# EAGLE design drive_and_recover (EAGLE 7.1.0)
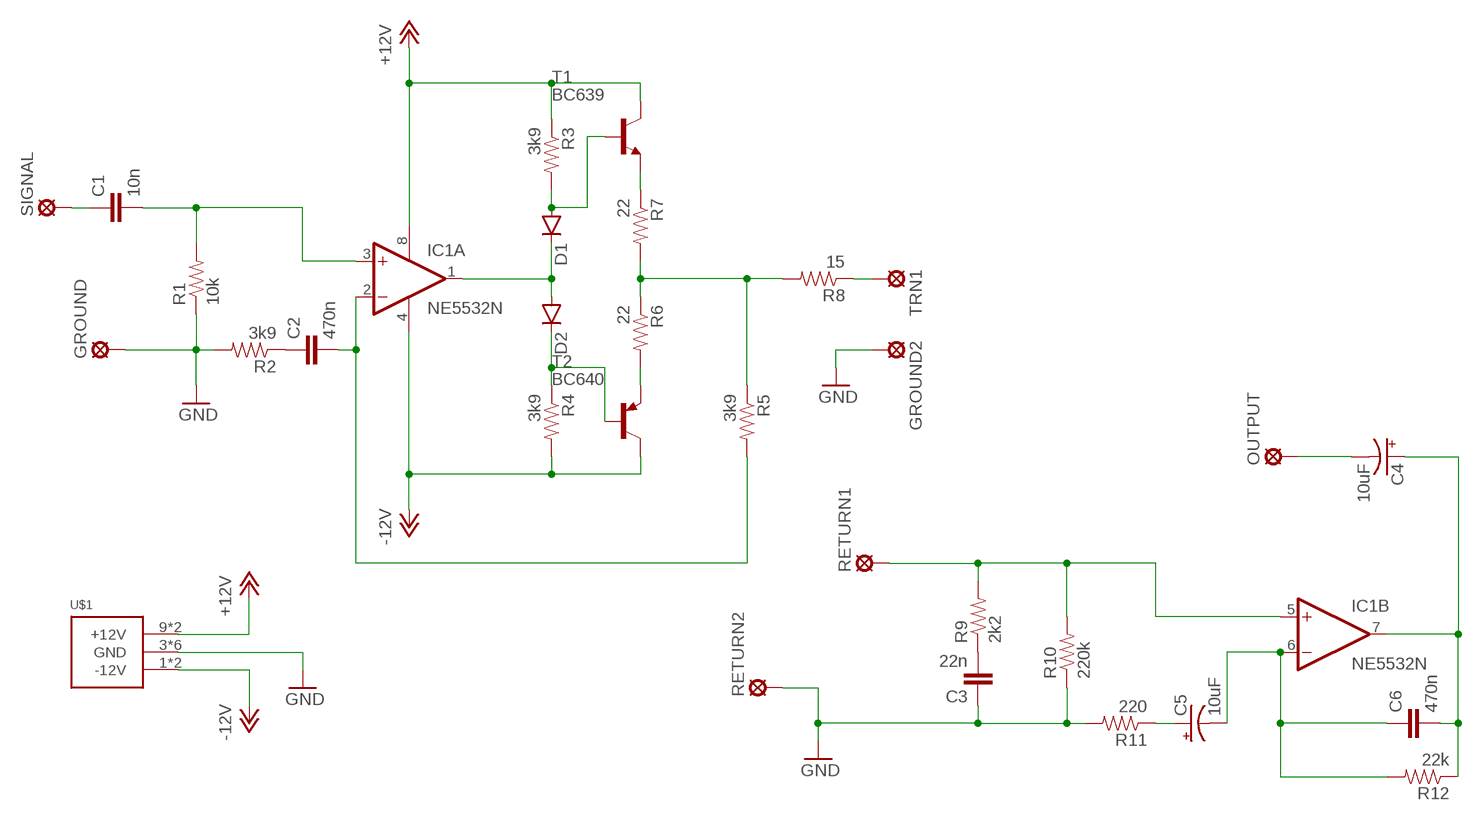
[diagram p0: schematic, sheet 1]

## Parts
C1  10n  CAPPTH  [CAP-PTH-SMALL]
C2  470n  CAPPTH  [CAP-PTH-SMALL]
C3  22n  CAPPTH  [CAP-PTH-SMALL]
C4  10uF  CPOL-USE2-5  [E2-5]
C5  10uF  CPOL-USE2-5  [E2-5]
C6  470n  CAPPTH  [CAP-PTH-SMALL]
D1  DIODE1N4148  [DIODE-1N4148]
D2  DIODE1N4148  [DIODE-1N4148]
GROUND  LSP10  [LSP10]
GROUND2  LSP10  [LSP10]
IC1  NE5532N  [DIL08]
OUTPUT  LSP10  [LSP10]
R1  10k  RESISTORPTH-1/4W  [AXIAL-0.4]
R2  3k9  RESISTORPTH-1/4W  [AXIAL-0.4]
R3  3k9  RESISTORPTH-1/4W  [AXIAL-0.4]
R4  3k9  RESISTORPTH-1/4W  [AXIAL-0.4]
R5  3k9  RESISTORPTH-1/4W  [AXIAL-0.4]
R6  22  RESISTORPTH-1/4W  [AXIAL-0.4]
R7  22  RESISTORPTH-1/4W  [AXIAL-0.4]
R8  15  RESISTORPTH-1/4W  [AXIAL-0.4]
R9  2k2  RESISTORPTH-1/4W  [AXIAL-0.4]
R10  220k  RESISTORPTH-1/4W  [AXIAL-0.4]
R11  220  RESISTORPTH-1/4W  [AXIAL-0.4]
R12  22k  RESISTORPTH-1/4W  [AXIAL-0.4]
RETURN1  LSP10  [LSP10]
RETURN2  LSP10  [LSP10]
SIGNAL  LSP10  [LSP10]
T1  BC639  BC639-NPN-TO92-ECB  [TO92-ECB]
T2  BC640  BC640-PNP-TO92-BCE  [TO92-BCE]
TRN1  LSP10  [LSP10]
U$1  POWER_SIMPLE16  [POWER_16]

## Nets
+12V: IC1.8(P:V+) R3.P$1 T1.C U$1.9(+12V) U$1.10(+12V)
-12V: IC1.4(P:V-) R4.P$2 T2.C U$1.1(-12V) U$1.2(-12V)
GND: C3.1 GROUND2.MP GROUND.MP R1.P$1 R2.P$2 R10.P$1 R11.P$2 RETURN2.MP U$1.3(GND) U$1.4(GND) U$1.5(GND) U$1.6(GND) U$1.7(GND) U$1.8(GND)
N$1: C1.1 SIGNAL.MP
N$2: C1.2 IC1.3(A:+IN) R1.P$2
N$3: D1.C D2.A IC1.1(A:OUT)
N$4: C2.1 R2.P$1
N$5: D1.A R3.P$2 T1.B
N$6: C2.2 IC1.2(A:-IN) R5.P$2
N$7: C3.2 R9.P$1
N$8: C5.+ R11.P$1
N$9: IC1.5(B:+IN) R9.P$2 R10.P$2 RETURN1.MP
N$10: C4.- OUTPUT.MP
N$11: D2.C R4.P$1 T2.B
N$12: R5.P$1 R6.P$1 R7.P$2 R8.P$2
N$14: C5.- C6.1 IC1.6(B:-IN) R12.P$2
N$15: R7.P$1 T1.E
N$16: R6.P$2 T2.E
N$17: C4.+ C6.2 IC1.7(B:OUT) R12.P$1
N$18: R8.P$1 TRN1.MP

## Library data of the parts
C1-C3 C6 = SparkFun-Capacitors:CAP: Capacitor Standard 0603 ceramic capacitor, and 0.1" leaded capacitor.
C4 C5 = rcl:CPOL-US: POLARIZED CAPACITOR, American symbol
D1 D2 = SparkFun-DiscreteSemi:DIODE: Diode These are standard reverse protection diodes and small signal diodes. SMA package can handle up to about 1A. SOD-323 can handle about 200mA. What the SOD-323 package when ordering, there are some mfgs out there that are 5-pin packages.
GROUND GROUND2 OUTPUT RETURN1 RETURN2 SIGNAL TRN1 = solpad:LSP10: SOLDER PAD drill 1.0 mm, distributor Buerklin, 12H555
IC1 = linear:NE5532: AUDIO AMPLIFIER
R1-R12 = SparkFun-Resistors:RESISTOR: Resistor Basic schematic elements and footprints for 0603, 1206, and PTH resistors.
T1 = transistor:*-NPN-: NPN Transistror BF959 corrected 2008.03.06
T2 = transistor:*-PNP-: PNP Transistror
U$1 = eurorack:POWER_SIMPLE

## Board
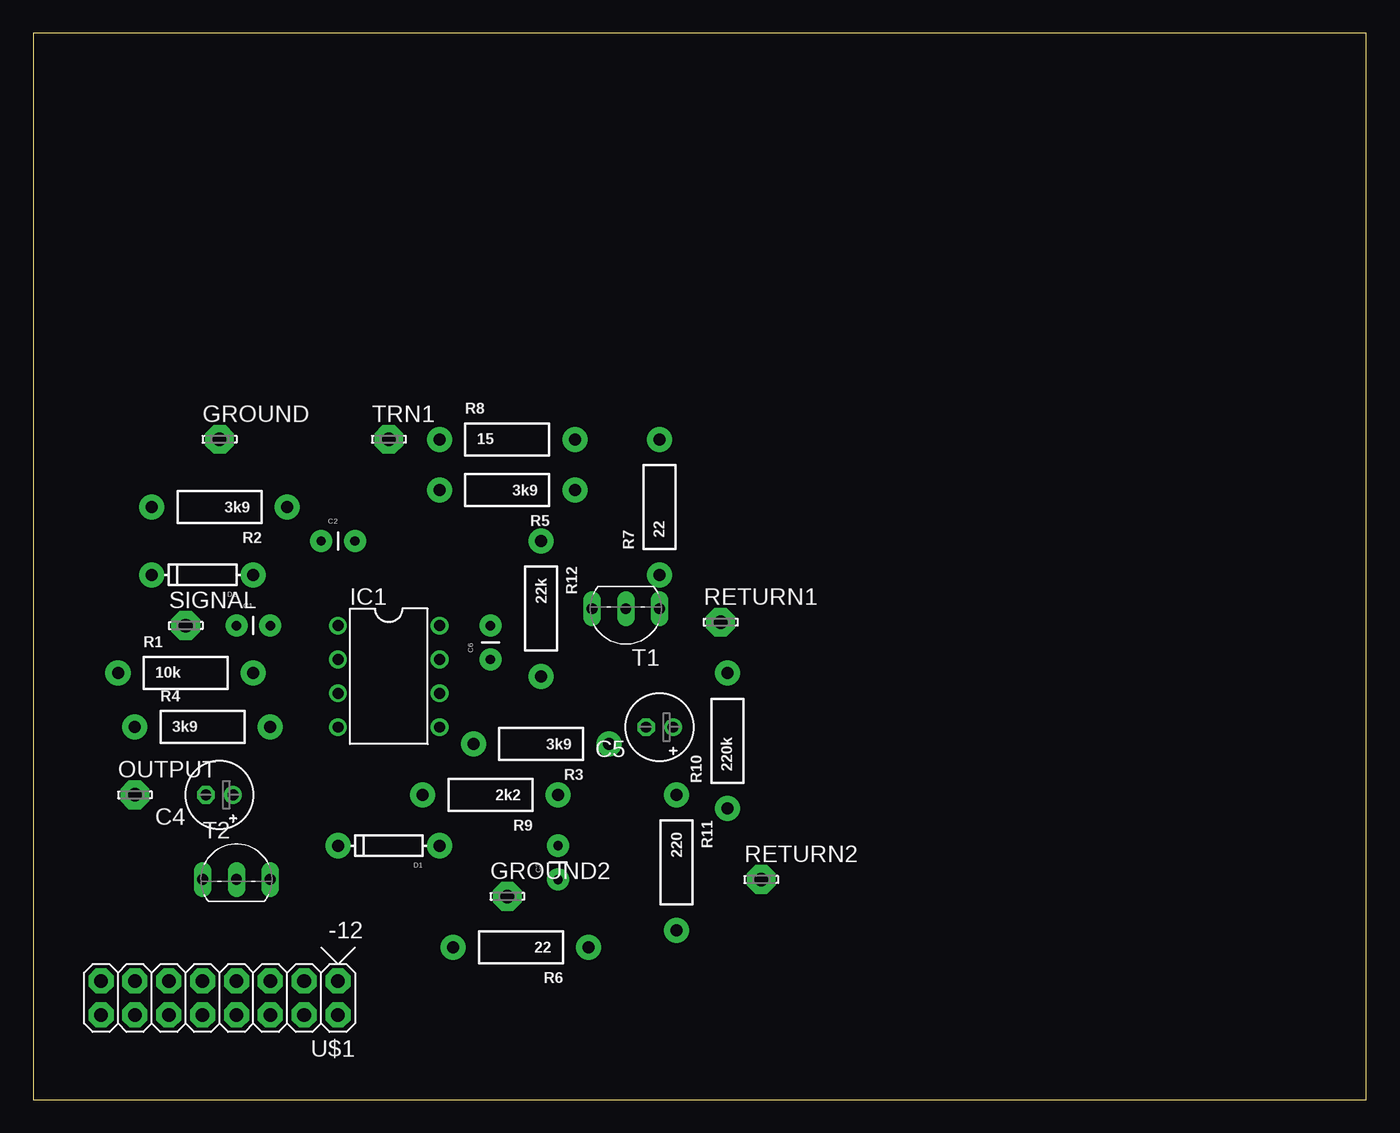
[diagram p1: board, top side]
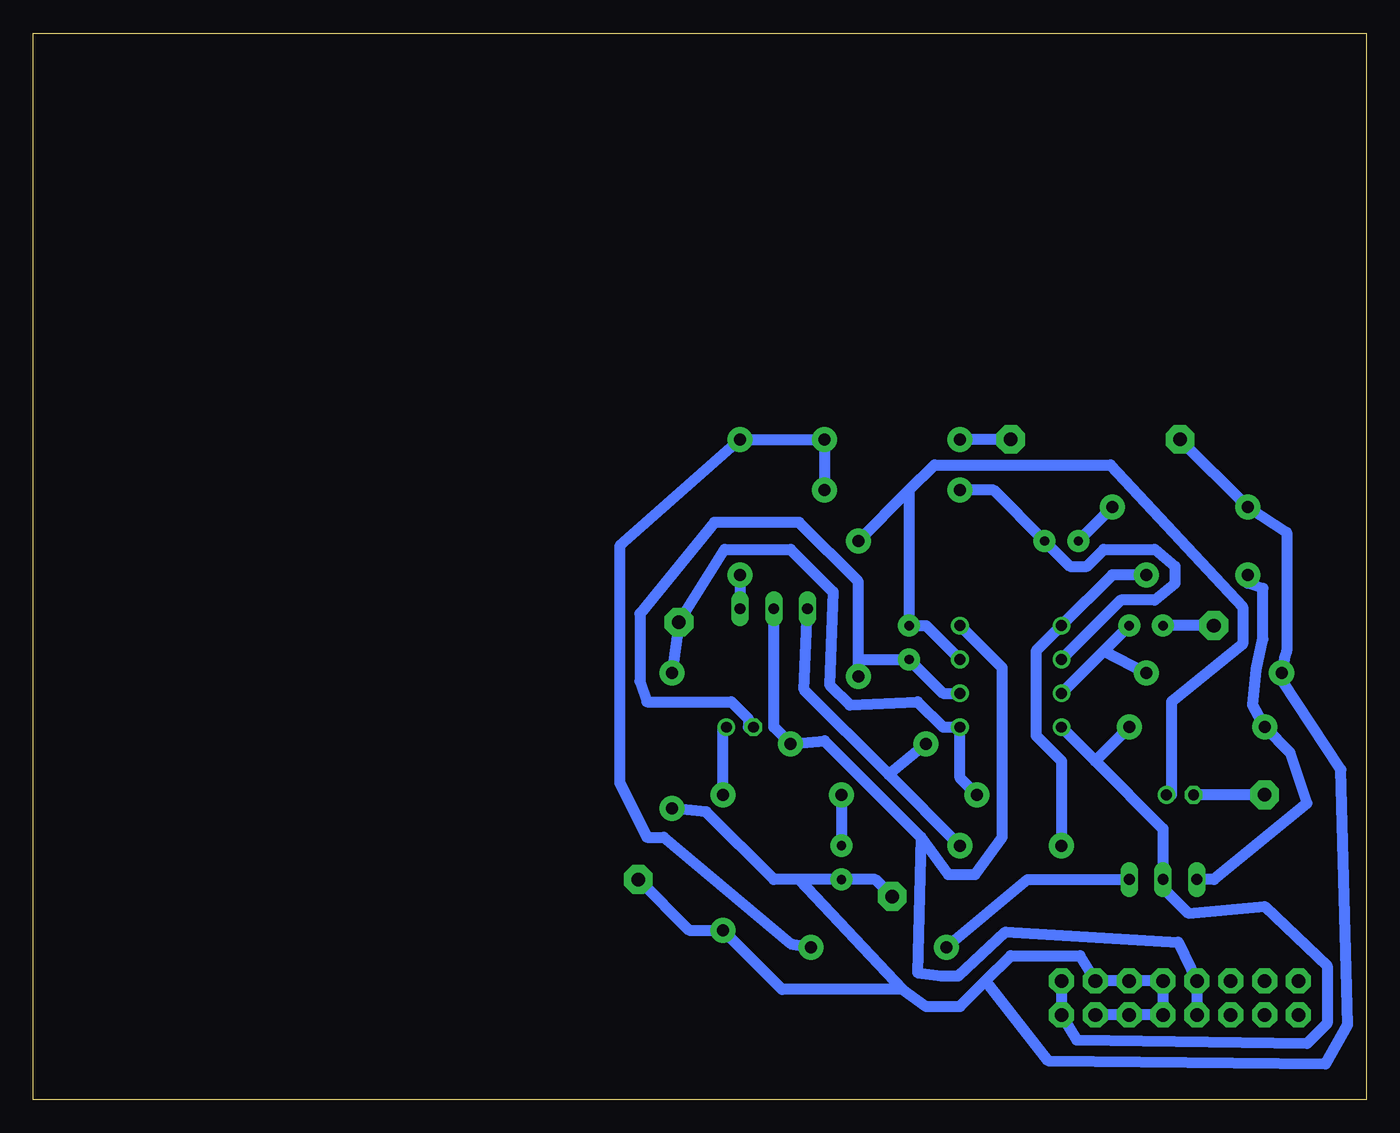
[diagram p2: board, bottom side, seen from below]

Size 100 x 80 mm. Coordinates in mm from the lower left corner, seen from the top.
Outline: 0,0 100,0 100,80 0,80 0,0
Copper layers (1*16): Top 0.035mm / dielectric 1.5mm / Bottom 0.035mm
Design rules "default *": minimum track width 32mil, minimum drill 24mil, track to track 12mil, track to pad 12mil, pad to pad 12mil, via to via 12mil, smd to smd 8mil, copper to edge 10mil, drill to drill 12mil, minimum pad ring 10mil, minimum via ring 8mil, stop-mask expansion 4mil, vias tented up to drill 0mil, thermal gap 10mil

### Footprints (pad centres in the part's own frame; a part is rotated, then mirrored left to right if it is on the bottom)
CAP-PTH-SMALL = drill 0.7 pad 1.651: 1 0,0; 2 2.54,0
E2-5 = drill 0.813 pad 1.27: + -1.016,0 | drill 0.813 pad 1.27 octagon: - 1.016,0
DIODE-1N4148 = drill 0.9 pad 1.88: A -3.81,0; C 3.81,0
LSP10 = drill 1.016 pad 2.159 octagon: MP 0,0
DIL08 = drill 0.813 pad 1.27: 1 -3.81,-3.81; 2 -1.27,-3.81; 3 1.27,-3.81; 4 3.81,-3.81; 5 3.81,3.81; 6 1.27,3.81; 7 -1.27,3.81; 8 -3.81,3.81
AXIAL-0.4 = drill 0.9 pad 1.88: P$1 -5.08,0; P$2 5.08,0
TO92-ECB = drill 0.813 long: B 2.54,0; C 0,0; E -2.54,0
TO92-BCE = drill 0.813 long: B -2.54,0; C 0,0; E 2.54,0
POWER_16 = drill 1.016 pad 1.88 octagon: 1 -6.35,-1.27; 2 -6.35,1.27; 3 -3.81,-1.27; 4 -3.81,1.27; 5 -1.27,-1.27; 6 -1.27,1.27; 7 1.27,-1.27; 8 1.27,1.27; 9 3.81,-1.27; 10 3.81,1.27; 11 6.35,-1.27; 12 6.35,1.27; 13 8.89,-1.27; 14 8.89,1.27; 15 11.43,-1.27; 16 11.43,1.27

### Placement (x,y rotation side)
C1  15.24,35.56 0 top
C2  21.59,41.91 0 top
C3  39.37,16.51 90 top
C4  13.97,22.86 180 top
C5  46.99,27.94 180 top
C6  34.29,33.02 90 top
D1  26.67,19.05 180 top
D2  12.7,39.37 180 top
GROUND  13.97,49.53 0 top
GROUND2  35.56,15.24 0 top
IC1  26.67,31.75 270 top
OUTPUT  7.62,22.86 0 top
R1  11.43,32 0 top
R2  13.97,44.45 180 top
R3  38.1,26.67 180 top
R4  12.7,27.94 0 top
R5  35.56,45.72 180 top
R6  36.58,11.43 180 top
R7  46.99,44.45 90 top
R8  35.56,49.53 0 top
R9  34.29,22.86 180 top
R10  52.07,26.92 90 top
R11  48.26,17.78 270 top
R12  38.1,36.83 270 top
RETURN1  51.56,35.81 0 top
RETURN2  54.61,16.51 0 top
SIGNAL  11.43,35.56 0 top
T1  44.45,36.83 180 top
T2  15.24,16.51 0 top
TRN1  26.67,49.53 0 top
U$1  16.51,7.62 180 top

### Tracks (layer width: path | path; a pad name or v marks a point on that pad's centre or on a via)
+12V
  Bottom 0.813: U$1.10 U$1.9 14.1,11.81 27.05,12.57 30.61,9.27 31.88,9.27 33.66,9.53 33.4,19.68 | IC1.8 27.3,32.38 27.3,19.68 29.34,16.89 31.37,16.89 33.4,19.68 | 33.4,19.68 40.64,26.92 R3.P$1 44.45,27.94 T1.C
-12V
  Bottom 0.813: U$1.1 U$1.2 21.72,4.45 4.45,4.19 2.92,5.71 2.92,10.03 7.62,14.48 13.34,13.97 15.24,15.88 T2.C 15.24,20.32 20.32,25.4 | IC1.4 20.32,25.4 | 20.32,25.4 R4.P$2
GND
  Bottom 0.813: GROUND.MP R2.P$2 5.97,42.55 5.97,33.66 6.1,33.27 R1.P$1 6.35,31.5 1.91,24.77 1.4,5.59 3.05,2.67 23.88,2.92 28.57,8.89 | RETURN2.MP 50.8,12.7 R11.P$2 43.81,8.26 34.8,8.26 | U$1.4 U$1.6 U$1.8 U$1.7 U$1.5 U$1.3 21.46,10.79 26.67,10.79 28.57,8.89 | GROUND2.MP 36.83,16.51 C3.1 42.55,16.51 | R10.P$1 49.53,21.59 44.45,16.51 42.55,16.51 | 28.57,8.89 30.48,6.99 33.02,6.99 34.8,8.26 | 42.55,16.51 34.8,8.26
N$1
  Bottom 0.813: SIGNAL.MP C1.1
N$2
  Bottom 0.813: C1.2 19.68,33.66 | 19.68,33.66 IC1.3 | 19.68,33.66 R1.P$2
N$3
  Bottom 0.813: D2.A 19.05,39.37 IC1.1 24.77,33.66 24.77,27.3 22.86,25.4 D1.C
N$4
  Bottom 0.813: R2.P$1 C2.1
N$5
  Bottom 0.813: T1.B 42.16,30.73 35.81,24.38 | D1.A 35.81,24.38 | 35.81,24.38 R3.P$2
N$6
  Bottom 0.813: IC1.2 18.41,37.47 15.88,37.47 14.35,38.73 14.35,40.01 15.88,41.27 19.68,41.27 20.95,40.01 22.23,40.01 C2.2 27.94,45.72 R5.P$2
N$7
  Bottom 0.813: R9.P$1 C3.2
N$8
  Bottom 0.813: R11.P$1 48.26,27.94 C5.+
N$9
  Bottom 0.813: R9.P$2 30.48,24.13 IC1.5 31.75,27.94 33.66,29.84 38.73,29.59 40.26,31.11 40.01,38.1 43.18,41.27 48.13,41.27 RETURN1.MP R10.P$2
N$10
  Bottom 0.813: OUTPUT.MP C4.-
N$11
  Bottom 0.813: T2.B 11.43,16.51 4.45,22.23 5.71,26.04 R4.P$1 8.51,29.59 8.26,32.26 7.75,34.54 7.75,38.35 8.89,38.73 D2.C
N$12
  Bottom 0.813: R5.P$1 R8.P$2 R7.P$2 56.01,41.53 56.01,23.75 53.98,19.68 52.7,19.68 43.18,11.68 R6.P$1
N$14
  Bottom 0.813: IC1.6 31.75,30.48 C6.1 38.1,33.02 | R12.P$2 38.1,33.02 | 38.1,33.02 38.1,38.86 42.55,43.31 48.9,43.31 54.48,36.45 54.48,31.37 53.98,29.84 47.62,29.84 46.35,28.57 46.35,27.94 C5.-
N$15
  Bottom 0.813: R7.P$1 T1.E
N$16
  Bottom 0.813: T2.E 25.4,16.51 R6.P$2
N$17
  Bottom 0.813: IC1.7 33.02,35.56 C6.2 34.29,45.72 | R12.P$1 34.29,45.72 | 34.29,45.72 32.38,47.62 19.18,47.62 9.27,36.96 9.27,34.16 14.61,29.84 14.61,22.86 C4.+
N$18
  Bottom 0.813: TRN1.MP R8.P$1